# EAGLE schematic LED Array (EAGLE 6.3)
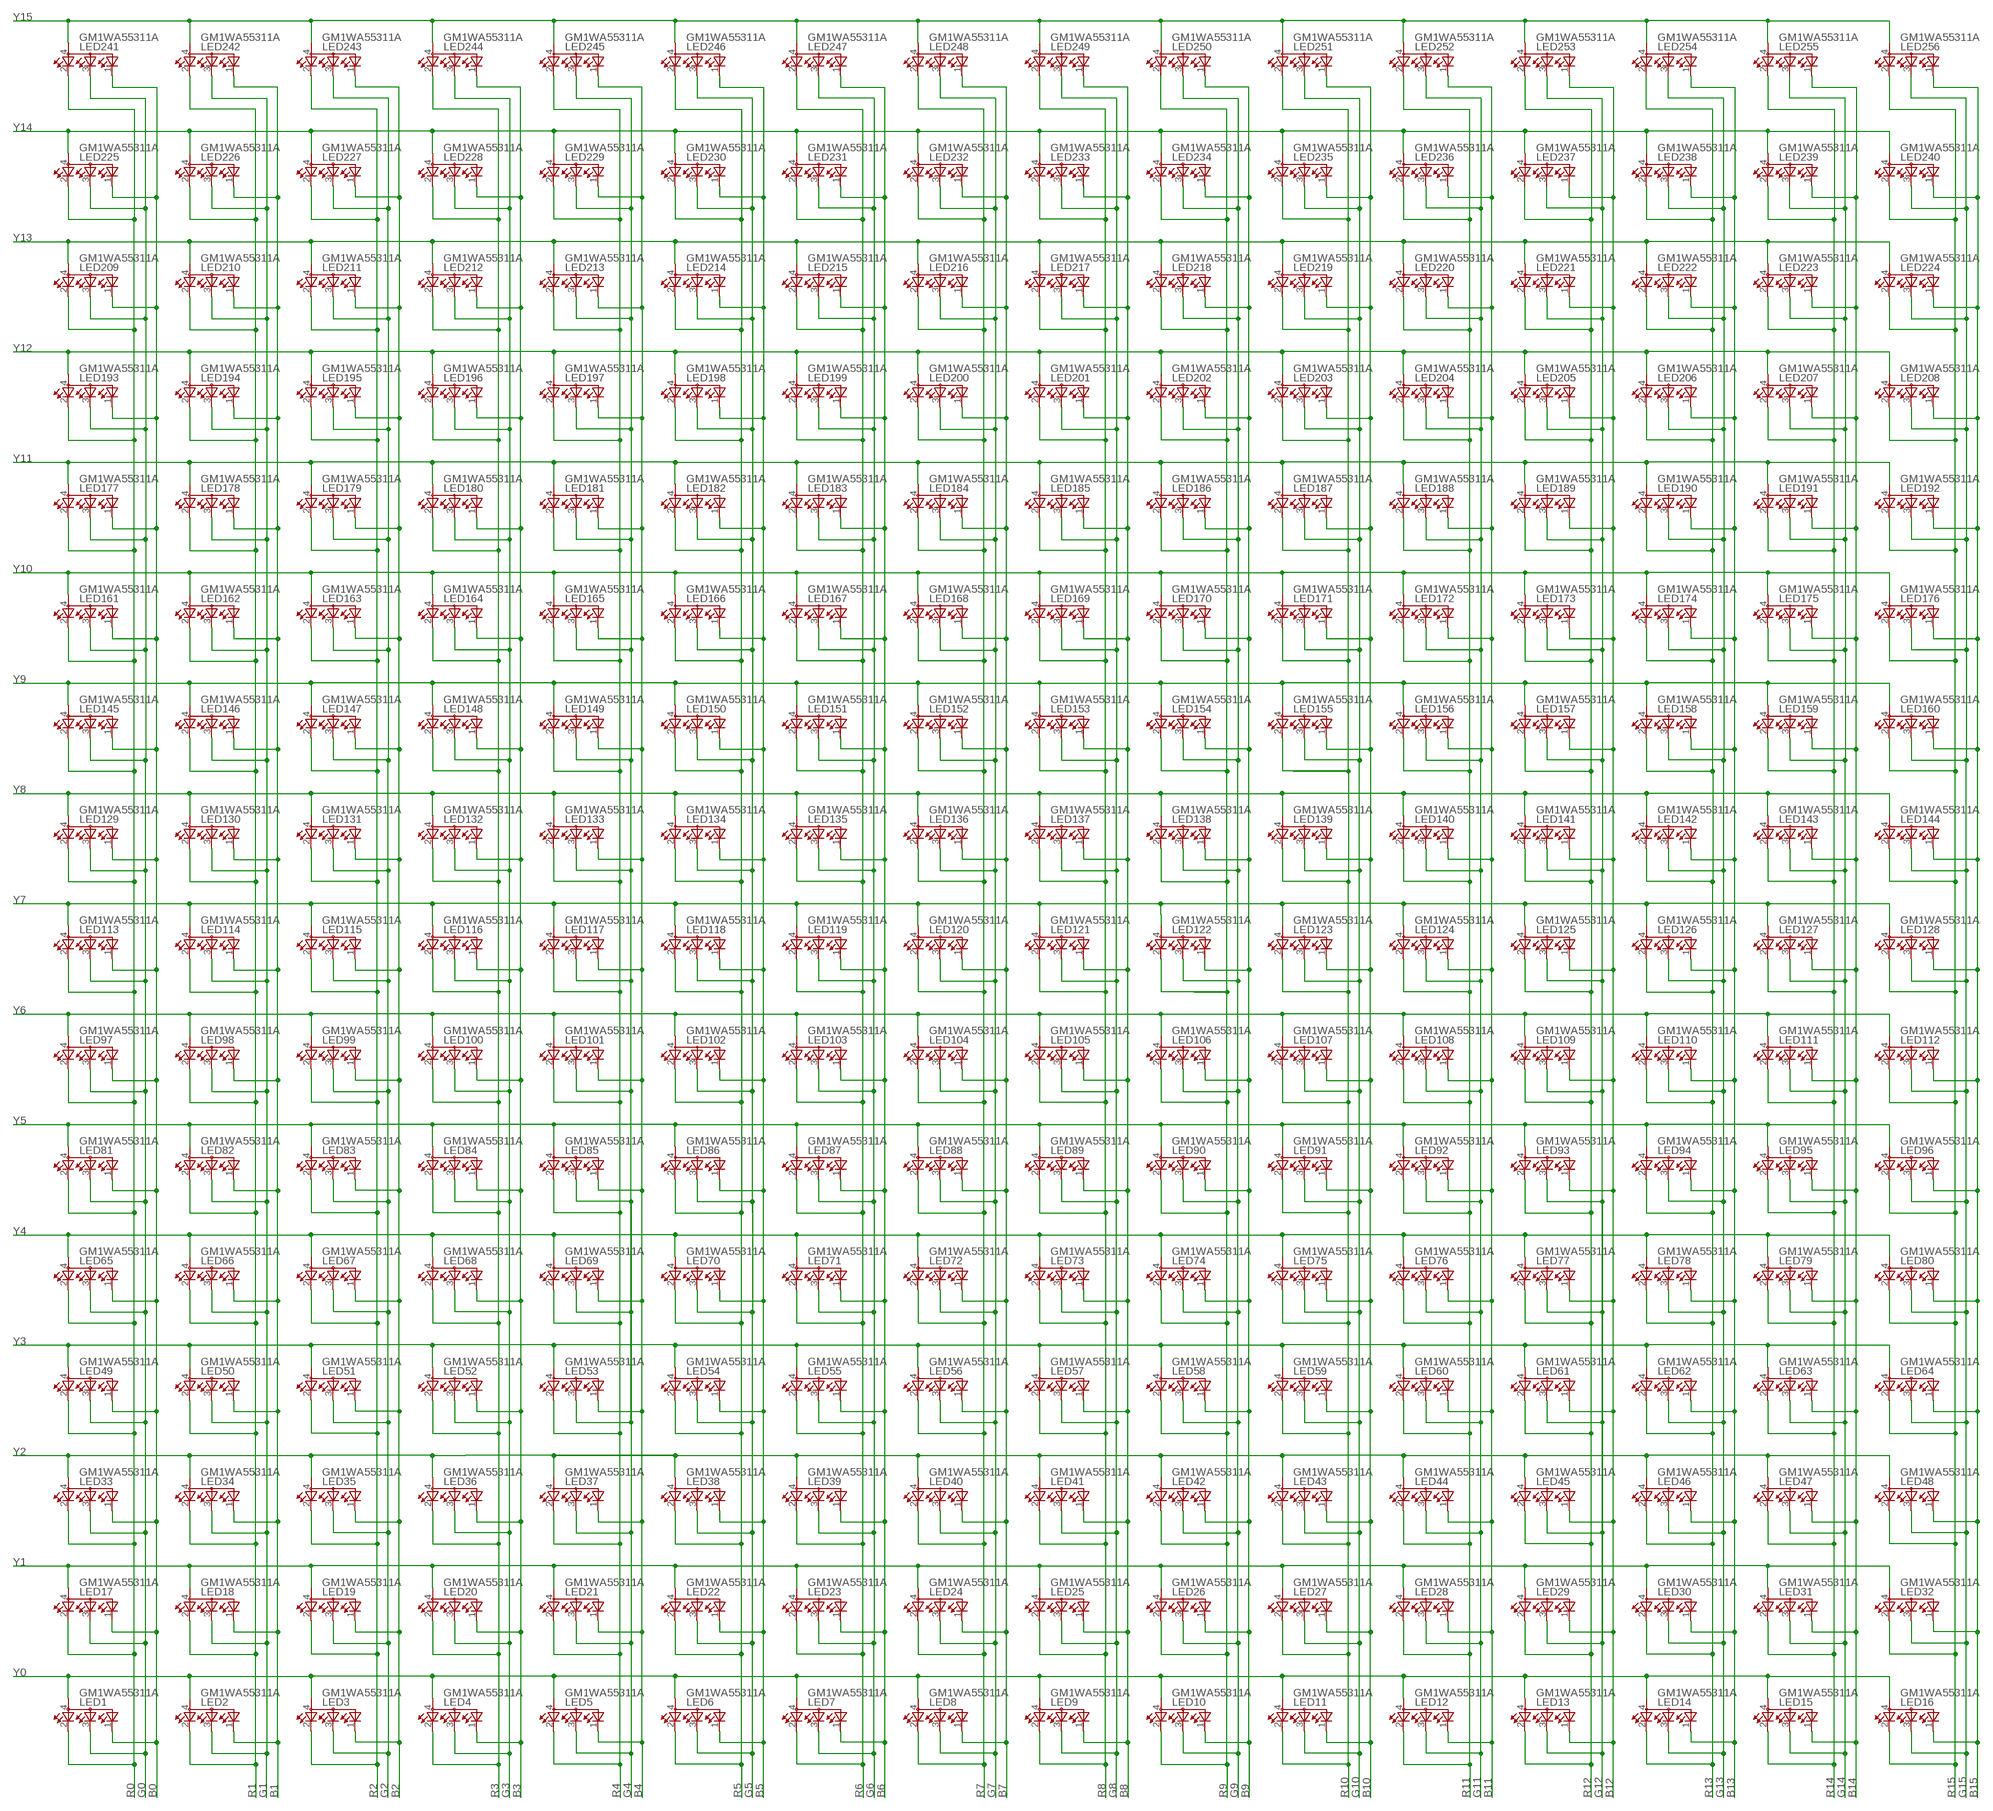
[diagram p0: schematic, sheet 1]

## Parts
LED1  GM1WA55311A  [GM1WA55311A]
LED2  GM1WA55311A  [GM1WA55311A]
LED3  GM1WA55311A  [GM1WA55311A]
LED4  GM1WA55311A  [GM1WA55311A]
LED5  GM1WA55311A  [GM1WA55311A]
LED6  GM1WA55311A  [GM1WA55311A]
LED7  GM1WA55311A  [GM1WA55311A]
LED8  GM1WA55311A  [GM1WA55311A]
LED9  GM1WA55311A  [GM1WA55311A]
LED10  GM1WA55311A  [GM1WA55311A]
LED11  GM1WA55311A  [GM1WA55311A]
LED12  GM1WA55311A  [GM1WA55311A]
LED13  GM1WA55311A  [GM1WA55311A]
LED14  GM1WA55311A  [GM1WA55311A]
LED15  GM1WA55311A  [GM1WA55311A]
LED16  GM1WA55311A  [GM1WA55311A]
LED17  GM1WA55311A  [GM1WA55311A]
LED18  GM1WA55311A  [GM1WA55311A]
LED19  GM1WA55311A  [GM1WA55311A]
LED20  GM1WA55311A  [GM1WA55311A]
LED21  GM1WA55311A  [GM1WA55311A]
LED22  GM1WA55311A  [GM1WA55311A]
LED23  GM1WA55311A  [GM1WA55311A]
LED24  GM1WA55311A  [GM1WA55311A]
LED25  GM1WA55311A  [GM1WA55311A]
LED26  GM1WA55311A  [GM1WA55311A]
LED27  GM1WA55311A  [GM1WA55311A]
LED28  GM1WA55311A  [GM1WA55311A]
LED29  GM1WA55311A  [GM1WA55311A]
LED30  GM1WA55311A  [GM1WA55311A]
LED31  GM1WA55311A  [GM1WA55311A]
LED32  GM1WA55311A  [GM1WA55311A]
LED33  GM1WA55311A  [GM1WA55311A]
LED34  GM1WA55311A  [GM1WA55311A]
LED35  GM1WA55311A  [GM1WA55311A]
LED36  GM1WA55311A  [GM1WA55311A]
LED37  GM1WA55311A  [GM1WA55311A]
LED38  GM1WA55311A  [GM1WA55311A]
LED39  GM1WA55311A  [GM1WA55311A]
LED40  GM1WA55311A  [GM1WA55311A]
LED41  GM1WA55311A  [GM1WA55311A]
LED42  GM1WA55311A  [GM1WA55311A]
LED43  GM1WA55311A  [GM1WA55311A]
LED44  GM1WA55311A  [GM1WA55311A]
LED45  GM1WA55311A  [GM1WA55311A]
LED46  GM1WA55311A  [GM1WA55311A]
LED47  GM1WA55311A  [GM1WA55311A]
LED48  GM1WA55311A  [GM1WA55311A]
LED49  GM1WA55311A  [GM1WA55311A]
LED50  GM1WA55311A  [GM1WA55311A]
LED51  GM1WA55311A  [GM1WA55311A]
LED52  GM1WA55311A  [GM1WA55311A]
LED53  GM1WA55311A  [GM1WA55311A]
LED54  GM1WA55311A  [GM1WA55311A]
LED55  GM1WA55311A  [GM1WA55311A]
LED56  GM1WA55311A  [GM1WA55311A]
LED57  GM1WA55311A  [GM1WA55311A]
LED58  GM1WA55311A  [GM1WA55311A]
LED59  GM1WA55311A  [GM1WA55311A]
LED60  GM1WA55311A  [GM1WA55311A]
LED61  GM1WA55311A  [GM1WA55311A]
LED62  GM1WA55311A  [GM1WA55311A]
LED63  GM1WA55311A  [GM1WA55311A]
LED64  GM1WA55311A  [GM1WA55311A]
LED65  GM1WA55311A  [GM1WA55311A]
LED66  GM1WA55311A  [GM1WA55311A]
LED67  GM1WA55311A  [GM1WA55311A]
LED68  GM1WA55311A  [GM1WA55311A]
LED69  GM1WA55311A  [GM1WA55311A]
LED70  GM1WA55311A  [GM1WA55311A]
LED71  GM1WA55311A  [GM1WA55311A]
LED72  GM1WA55311A  [GM1WA55311A]
LED73  GM1WA55311A  [GM1WA55311A]
LED74  GM1WA55311A  [GM1WA55311A]
LED75  GM1WA55311A  [GM1WA55311A]
LED76  GM1WA55311A  [GM1WA55311A]
LED77  GM1WA55311A  [GM1WA55311A]
LED78  GM1WA55311A  [GM1WA55311A]
LED79  GM1WA55311A  [GM1WA55311A]
LED80  GM1WA55311A  [GM1WA55311A]
LED81  GM1WA55311A  [GM1WA55311A]
LED82  GM1WA55311A  [GM1WA55311A]
LED83  GM1WA55311A  [GM1WA55311A]
LED84  GM1WA55311A  [GM1WA55311A]
LED85  GM1WA55311A  [GM1WA55311A]
LED86  GM1WA55311A  [GM1WA55311A]
LED87  GM1WA55311A  [GM1WA55311A]
LED88  GM1WA55311A  [GM1WA55311A]
LED89  GM1WA55311A  [GM1WA55311A]
LED90  GM1WA55311A  [GM1WA55311A]
LED91  GM1WA55311A  [GM1WA55311A]
LED92  GM1WA55311A  [GM1WA55311A]
LED93  GM1WA55311A  [GM1WA55311A]
LED94  GM1WA55311A  [GM1WA55311A]
LED95  GM1WA55311A  [GM1WA55311A]
LED96  GM1WA55311A  [GM1WA55311A]
LED97  GM1WA55311A  [GM1WA55311A]
LED98  GM1WA55311A  [GM1WA55311A]
LED99  GM1WA55311A  [GM1WA55311A]
LED100  GM1WA55311A  [GM1WA55311A]
LED101  GM1WA55311A  [GM1WA55311A]
LED102  GM1WA55311A  [GM1WA55311A]
LED103  GM1WA55311A  [GM1WA55311A]
LED104  GM1WA55311A  [GM1WA55311A]
LED105  GM1WA55311A  [GM1WA55311A]
LED106  GM1WA55311A  [GM1WA55311A]
LED107  GM1WA55311A  [GM1WA55311A]
LED108  GM1WA55311A  [GM1WA55311A]
LED109  GM1WA55311A  [GM1WA55311A]
LED110  GM1WA55311A  [GM1WA55311A]
LED111  GM1WA55311A  [GM1WA55311A]
LED112  GM1WA55311A  [GM1WA55311A]
LED113  GM1WA55311A  [GM1WA55311A]
LED114  GM1WA55311A  [GM1WA55311A]
LED115  GM1WA55311A  [GM1WA55311A]
LED116  GM1WA55311A  [GM1WA55311A]
LED117  GM1WA55311A  [GM1WA55311A]
LED118  GM1WA55311A  [GM1WA55311A]
LED119  GM1WA55311A  [GM1WA55311A]
LED120  GM1WA55311A  [GM1WA55311A]
LED121  GM1WA55311A  [GM1WA55311A]
LED122  GM1WA55311A  [GM1WA55311A]
LED123  GM1WA55311A  [GM1WA55311A]
LED124  GM1WA55311A  [GM1WA55311A]
LED125  GM1WA55311A  [GM1WA55311A]
LED126  GM1WA55311A  [GM1WA55311A]
LED127  GM1WA55311A  [GM1WA55311A]
LED128  GM1WA55311A  [GM1WA55311A]
LED129  GM1WA55311A  [GM1WA55311A]
LED130  GM1WA55311A  [GM1WA55311A]
LED131  GM1WA55311A  [GM1WA55311A]
LED132  GM1WA55311A  [GM1WA55311A]
LED133  GM1WA55311A  [GM1WA55311A]
LED134  GM1WA55311A  [GM1WA55311A]
LED135  GM1WA55311A  [GM1WA55311A]
LED136  GM1WA55311A  [GM1WA55311A]
LED137  GM1WA55311A  [GM1WA55311A]
LED138  GM1WA55311A  [GM1WA55311A]
LED139  GM1WA55311A  [GM1WA55311A]
LED140  GM1WA55311A  [GM1WA55311A]
LED141  GM1WA55311A  [GM1WA55311A]
LED142  GM1WA55311A  [GM1WA55311A]
LED143  GM1WA55311A  [GM1WA55311A]
LED144  GM1WA55311A  [GM1WA55311A]
LED145  GM1WA55311A  [GM1WA55311A]
LED146  GM1WA55311A  [GM1WA55311A]
LED147  GM1WA55311A  [GM1WA55311A]
LED148  GM1WA55311A  [GM1WA55311A]
LED149  GM1WA55311A  [GM1WA55311A]
LED150  GM1WA55311A  [GM1WA55311A]
LED151  GM1WA55311A  [GM1WA55311A]
LED152  GM1WA55311A  [GM1WA55311A]
LED153  GM1WA55311A  [GM1WA55311A]
LED154  GM1WA55311A  [GM1WA55311A]
LED155  GM1WA55311A  [GM1WA55311A]
LED156  GM1WA55311A  [GM1WA55311A]
LED157  GM1WA55311A  [GM1WA55311A]
LED158  GM1WA55311A  [GM1WA55311A]
LED159  GM1WA55311A  [GM1WA55311A]
LED160  GM1WA55311A  [GM1WA55311A]
LED161  GM1WA55311A  [GM1WA55311A]
LED162  GM1WA55311A  [GM1WA55311A]
LED163  GM1WA55311A  [GM1WA55311A]
LED164  GM1WA55311A  [GM1WA55311A]
LED165  GM1WA55311A  [GM1WA55311A]
LED166  GM1WA55311A  [GM1WA55311A]
LED167  GM1WA55311A  [GM1WA55311A]
LED168  GM1WA55311A  [GM1WA55311A]
LED169  GM1WA55311A  [GM1WA55311A]
LED170  GM1WA55311A  [GM1WA55311A]
LED171  GM1WA55311A  [GM1WA55311A]
LED172  GM1WA55311A  [GM1WA55311A]
LED173  GM1WA55311A  [GM1WA55311A]
LED174  GM1WA55311A  [GM1WA55311A]
LED175  GM1WA55311A  [GM1WA55311A]
LED176  GM1WA55311A  [GM1WA55311A]
LED177  GM1WA55311A  [GM1WA55311A]
LED178  GM1WA55311A  [GM1WA55311A]
LED179  GM1WA55311A  [GM1WA55311A]
LED180  GM1WA55311A  [GM1WA55311A]
LED181  GM1WA55311A  [GM1WA55311A]
LED182  GM1WA55311A  [GM1WA55311A]
LED183  GM1WA55311A  [GM1WA55311A]
LED184  GM1WA55311A  [GM1WA55311A]
LED185  GM1WA55311A  [GM1WA55311A]
LED186  GM1WA55311A  [GM1WA55311A]
LED187  GM1WA55311A  [GM1WA55311A]
LED188  GM1WA55311A  [GM1WA55311A]
LED189  GM1WA55311A  [GM1WA55311A]
LED190  GM1WA55311A  [GM1WA55311A]
LED191  GM1WA55311A  [GM1WA55311A]
LED192  GM1WA55311A  [GM1WA55311A]
LED193  GM1WA55311A  [GM1WA55311A]
LED194  GM1WA55311A  [GM1WA55311A]
LED195  GM1WA55311A  [GM1WA55311A]
LED196  GM1WA55311A  [GM1WA55311A]
LED197  GM1WA55311A  [GM1WA55311A]
LED198  GM1WA55311A  [GM1WA55311A]
LED199  GM1WA55311A  [GM1WA55311A]
LED200  GM1WA55311A  [GM1WA55311A]
LED201  GM1WA55311A  [GM1WA55311A]
LED202  GM1WA55311A  [GM1WA55311A]
LED203  GM1WA55311A  [GM1WA55311A]
LED204  GM1WA55311A  [GM1WA55311A]
LED205  GM1WA55311A  [GM1WA55311A]
LED206  GM1WA55311A  [GM1WA55311A]
LED207  GM1WA55311A  [GM1WA55311A]
LED208  GM1WA55311A  [GM1WA55311A]
LED209  GM1WA55311A  [GM1WA55311A]
LED210  GM1WA55311A  [GM1WA55311A]
LED211  GM1WA55311A  [GM1WA55311A]
LED212  GM1WA55311A  [GM1WA55311A]
LED213  GM1WA55311A  [GM1WA55311A]
LED214  GM1WA55311A  [GM1WA55311A]
LED215  GM1WA55311A  [GM1WA55311A]
LED216  GM1WA55311A  [GM1WA55311A]
LED217  GM1WA55311A  [GM1WA55311A]
LED218  GM1WA55311A  [GM1WA55311A]
LED219  GM1WA55311A  [GM1WA55311A]
LED220  GM1WA55311A  [GM1WA55311A]
LED221  GM1WA55311A  [GM1WA55311A]
LED222  GM1WA55311A  [GM1WA55311A]
LED223  GM1WA55311A  [GM1WA55311A]
LED224  GM1WA55311A  [GM1WA55311A]
LED225  GM1WA55311A  [GM1WA55311A]
LED226  GM1WA55311A  [GM1WA55311A]
LED227  GM1WA55311A  [GM1WA55311A]
LED228  GM1WA55311A  [GM1WA55311A]
LED229  GM1WA55311A  [GM1WA55311A]
LED230  GM1WA55311A  [GM1WA55311A]
LED231  GM1WA55311A  [GM1WA55311A]
LED232  GM1WA55311A  [GM1WA55311A]
LED233  GM1WA55311A  [GM1WA55311A]
LED234  GM1WA55311A  [GM1WA55311A]
LED235  GM1WA55311A  [GM1WA55311A]
LED236  GM1WA55311A  [GM1WA55311A]
LED237  GM1WA55311A  [GM1WA55311A]
LED238  GM1WA55311A  [GM1WA55311A]
LED239  GM1WA55311A  [GM1WA55311A]
LED240  GM1WA55311A  [GM1WA55311A]
LED241  GM1WA55311A  [GM1WA55311A]
LED242  GM1WA55311A  [GM1WA55311A]
LED243  GM1WA55311A  [GM1WA55311A]
LED244  GM1WA55311A  [GM1WA55311A]
LED245  GM1WA55311A  [GM1WA55311A]
LED246  GM1WA55311A  [GM1WA55311A]
LED247  GM1WA55311A  [GM1WA55311A]
LED248  GM1WA55311A  [GM1WA55311A]
LED249  GM1WA55311A  [GM1WA55311A]
LED250  GM1WA55311A  [GM1WA55311A]
LED251  GM1WA55311A  [GM1WA55311A]
LED252  GM1WA55311A  [GM1WA55311A]
LED253  GM1WA55311A  [GM1WA55311A]
LED254  GM1WA55311A  [GM1WA55311A]
LED255  GM1WA55311A  [GM1WA55311A]
LED256  GM1WA55311A  [GM1WA55311A]

## Nets
B0: LED1.1(CGREEN) LED17.1(CGREEN) LED33.1(CGREEN) LED49.1(CGREEN) LED65.1(CGREEN) LED81.1(CGREEN) LED97.1(CGREEN) LED113.1(CGREEN) LED129.1(CGREEN) LED145.1(CGREEN) LED161.1(CGREEN) LED177.1(CGREEN) LED193.1(CGREEN) LED209.1(CGREEN) LED225.1(CGREEN) LED241.1(CGREEN)
B1: LED2.1(CGREEN) LED18.1(CGREEN) LED34.1(CGREEN) LED50.1(CGREEN) LED66.1(CGREEN) LED82.1(CGREEN) LED98.1(CGREEN) LED114.1(CGREEN) LED130.1(CGREEN) LED146.1(CGREEN) LED162.1(CGREEN) LED178.1(CGREEN) LED194.1(CGREEN) LED210.1(CGREEN) LED226.1(CGREEN) LED242.1(CGREEN)
B2: LED3.1(CGREEN) LED19.1(CGREEN) LED35.1(CGREEN) LED51.1(CGREEN) LED67.1(CGREEN) LED83.1(CGREEN) LED99.1(CGREEN) LED115.1(CGREEN) LED131.1(CGREEN) LED147.1(CGREEN) LED163.1(CGREEN) LED179.1(CGREEN) LED195.1(CGREEN) LED211.1(CGREEN) LED227.1(CGREEN) LED243.1(CGREEN)
B3: LED4.1(CGREEN) LED20.1(CGREEN) LED36.1(CGREEN) LED52.1(CGREEN) LED68.1(CGREEN) LED84.1(CGREEN) LED100.1(CGREEN) LED116.1(CGREEN) LED132.1(CGREEN) LED148.1(CGREEN) LED164.1(CGREEN) LED180.1(CGREEN) LED196.1(CGREEN) LED212.1(CGREEN) LED228.1(CGREEN) LED244.1(CGREEN)
B4: LED5.1(CGREEN) LED21.1(CGREEN) LED37.1(CGREEN) LED53.1(CGREEN) LED69.1(CGREEN) LED85.1(CGREEN) LED101.1(CGREEN) LED117.1(CGREEN) LED133.1(CGREEN) LED149.1(CGREEN) LED165.1(CGREEN) LED181.1(CGREEN) LED197.1(CGREEN) LED213.1(CGREEN) LED229.1(CGREEN) LED245.1(CGREEN)
B5: LED6.1(CGREEN) LED22.1(CGREEN) LED38.1(CGREEN) LED54.1(CGREEN) LED70.1(CGREEN) LED86.1(CGREEN) LED102.1(CGREEN) LED118.1(CGREEN) LED134.1(CGREEN) LED150.1(CGREEN) LED166.1(CGREEN) LED182.1(CGREEN) LED198.1(CGREEN) LED214.1(CGREEN) LED230.1(CGREEN) LED246.1(CGREEN)
B6: LED7.1(CGREEN) LED23.1(CGREEN) LED39.1(CGREEN) LED55.1(CGREEN) LED71.1(CGREEN) LED87.1(CGREEN) LED103.1(CGREEN) LED119.1(CGREEN) LED135.1(CGREEN) LED151.1(CGREEN) LED167.1(CGREEN) LED183.1(CGREEN) LED199.1(CGREEN) LED215.1(CGREEN) LED231.1(CGREEN) LED247.1(CGREEN)
B7: LED8.1(CGREEN) LED24.1(CGREEN) LED40.1(CGREEN) LED56.1(CGREEN) LED72.1(CGREEN) LED88.1(CGREEN) LED104.1(CGREEN) LED120.1(CGREEN) LED136.1(CGREEN) LED152.1(CGREEN) LED168.1(CGREEN) LED184.1(CGREEN) LED200.1(CGREEN) LED216.1(CGREEN) LED232.1(CGREEN) LED248.1(CGREEN)
B8: LED9.1(CGREEN) LED25.1(CGREEN) LED41.1(CGREEN) LED57.1(CGREEN) LED73.1(CGREEN) LED89.1(CGREEN) LED105.1(CGREEN) LED121.1(CGREEN) LED137.1(CGREEN) LED153.1(CGREEN) LED169.1(CGREEN) LED185.1(CGREEN) LED201.1(CGREEN) LED217.1(CGREEN) LED233.1(CGREEN) LED249.1(CGREEN)
B9: LED10.1(CGREEN) LED26.1(CGREEN) LED42.1(CGREEN) LED58.1(CGREEN) LED74.1(CGREEN) LED90.1(CGREEN) LED106.1(CGREEN) LED122.1(CGREEN) LED138.1(CGREEN) LED154.1(CGREEN) LED170.1(CGREEN) LED186.1(CGREEN) LED202.1(CGREEN) LED218.1(CGREEN) LED234.1(CGREEN) LED250.1(CGREEN)
B10: LED11.1(CGREEN) LED27.1(CGREEN) LED43.1(CGREEN) LED59.1(CGREEN) LED75.1(CGREEN) LED91.1(CGREEN) LED107.1(CGREEN) LED123.1(CGREEN) LED139.1(CGREEN) LED155.1(CGREEN) LED171.1(CGREEN) LED187.1(CGREEN) LED203.1(CGREEN) LED219.1(CGREEN) LED235.1(CGREEN) LED251.1(CGREEN)
B11: LED12.1(CGREEN) LED28.1(CGREEN) LED44.1(CGREEN) LED60.1(CGREEN) LED76.1(CGREEN) LED92.1(CGREEN) LED108.1(CGREEN) LED124.1(CGREEN) LED140.1(CGREEN) LED156.1(CGREEN) LED172.1(CGREEN) LED188.1(CGREEN) LED204.1(CGREEN) LED220.1(CGREEN) LED236.1(CGREEN) LED252.1(CGREEN)
B12: LED13.1(CGREEN) LED29.1(CGREEN) LED45.1(CGREEN) LED61.1(CGREEN) LED77.1(CGREEN) LED93.1(CGREEN) LED109.1(CGREEN) LED125.1(CGREEN) LED141.1(CGREEN) LED157.1(CGREEN) LED173.1(CGREEN) LED189.1(CGREEN) LED205.1(CGREEN) LED221.1(CGREEN) LED237.1(CGREEN) LED253.1(CGREEN)
B13: LED14.1(CGREEN) LED30.1(CGREEN) LED46.1(CGREEN) LED62.1(CGREEN) LED78.1(CGREEN) LED94.1(CGREEN) LED110.1(CGREEN) LED126.1(CGREEN) LED142.1(CGREEN) LED158.1(CGREEN) LED174.1(CGREEN) LED190.1(CGREEN) LED206.1(CGREEN) LED222.1(CGREEN) LED238.1(CGREEN) LED254.1(CGREEN)
B14: LED15.1(CGREEN) LED31.1(CGREEN) LED47.1(CGREEN) LED63.1(CGREEN) LED79.1(CGREEN) LED95.1(CGREEN) LED111.1(CGREEN) LED127.1(CGREEN) LED143.1(CGREEN) LED159.1(CGREEN) LED175.1(CGREEN) LED191.1(CGREEN) LED207.1(CGREEN) LED223.1(CGREEN) LED239.1(CGREEN) LED255.1(CGREEN)
B15: LED16.1(CGREEN) LED32.1(CGREEN) LED48.1(CGREEN) LED64.1(CGREEN) LED80.1(CGREEN) LED96.1(CGREEN) LED112.1(CGREEN) LED128.1(CGREEN) LED144.1(CGREEN) LED160.1(CGREEN) LED176.1(CGREEN) LED192.1(CGREEN) LED208.1(CGREEN) LED224.1(CGREEN) LED240.1(CGREEN) LED256.1(CGREEN)
G0: LED1.3(CBLUE) LED17.3(CBLUE) LED33.3(CBLUE) LED49.3(CBLUE) LED65.3(CBLUE) LED81.3(CBLUE) LED97.3(CBLUE) LED113.3(CBLUE) LED129.3(CBLUE) LED145.3(CBLUE) LED161.3(CBLUE) LED177.3(CBLUE) LED193.3(CBLUE) LED209.3(CBLUE) LED225.3(CBLUE) LED241.3(CBLUE)
G1: LED2.3(CBLUE) LED18.3(CBLUE) LED34.3(CBLUE) LED50.3(CBLUE) LED66.3(CBLUE) LED82.3(CBLUE) LED98.3(CBLUE) LED114.3(CBLUE) LED130.3(CBLUE) LED146.3(CBLUE) LED162.3(CBLUE) LED178.3(CBLUE) LED194.3(CBLUE) LED210.3(CBLUE) LED226.3(CBLUE) LED242.3(CBLUE)
G2: LED3.3(CBLUE) LED19.3(CBLUE) LED35.3(CBLUE) LED51.3(CBLUE) LED67.3(CBLUE) LED83.3(CBLUE) LED99.3(CBLUE) LED115.3(CBLUE) LED131.3(CBLUE) LED147.3(CBLUE) LED163.3(CBLUE) LED179.3(CBLUE) LED195.3(CBLUE) LED211.3(CBLUE) LED227.3(CBLUE) LED243.3(CBLUE)
G3: LED4.3(CBLUE) LED20.3(CBLUE) LED36.3(CBLUE) LED52.3(CBLUE) LED68.3(CBLUE) LED84.3(CBLUE) LED100.3(CBLUE) LED116.3(CBLUE) LED132.3(CBLUE) LED148.3(CBLUE) LED164.3(CBLUE) LED180.3(CBLUE) LED196.3(CBLUE) LED212.3(CBLUE) LED228.3(CBLUE) LED244.3(CBLUE)
G4: LED5.3(CBLUE) LED21.3(CBLUE) LED37.3(CBLUE) LED53.3(CBLUE) LED69.3(CBLUE) LED85.3(CBLUE) LED101.3(CBLUE) LED117.3(CBLUE) LED133.3(CBLUE) LED149.3(CBLUE) LED165.3(CBLUE) LED181.3(CBLUE) LED197.3(CBLUE) LED213.3(CBLUE) LED229.3(CBLUE) LED245.3(CBLUE)
G5: LED6.3(CBLUE) LED22.3(CBLUE) LED38.3(CBLUE) LED54.3(CBLUE) LED70.3(CBLUE) LED86.3(CBLUE) LED102.3(CBLUE) LED118.3(CBLUE) LED134.3(CBLUE) LED150.3(CBLUE) LED166.3(CBLUE) LED182.3(CBLUE) LED198.3(CBLUE) LED214.3(CBLUE) LED230.3(CBLUE) LED246.3(CBLUE)
G6: LED7.3(CBLUE) LED23.3(CBLUE) LED39.3(CBLUE) LED55.3(CBLUE) LED71.3(CBLUE) LED87.3(CBLUE) LED103.3(CBLUE) LED119.3(CBLUE) LED135.3(CBLUE) LED151.3(CBLUE) LED167.3(CBLUE) LED183.3(CBLUE) LED199.3(CBLUE) LED215.3(CBLUE) LED231.3(CBLUE) LED247.3(CBLUE)
G7: LED8.3(CBLUE) LED24.3(CBLUE) LED40.3(CBLUE) LED56.3(CBLUE) LED72.3(CBLUE) LED88.3(CBLUE) LED104.3(CBLUE) LED120.3(CBLUE) LED136.3(CBLUE) LED152.3(CBLUE) LED168.3(CBLUE) LED184.3(CBLUE) LED200.3(CBLUE) LED216.3(CBLUE) LED232.3(CBLUE) LED248.3(CBLUE)
G8: LED9.3(CBLUE) LED25.3(CBLUE) LED41.3(CBLUE) LED57.3(CBLUE) LED73.3(CBLUE) LED89.3(CBLUE) LED105.3(CBLUE) LED121.3(CBLUE) LED137.3(CBLUE) LED153.3(CBLUE) LED169.3(CBLUE) LED185.3(CBLUE) LED201.3(CBLUE) LED217.3(CBLUE) LED233.3(CBLUE) LED249.3(CBLUE)
G9: LED10.3(CBLUE) LED26.3(CBLUE) LED42.3(CBLUE) LED58.3(CBLUE) LED74.3(CBLUE) LED90.3(CBLUE) LED106.3(CBLUE) LED122.3(CBLUE) LED138.3(CBLUE) LED154.3(CBLUE) LED170.3(CBLUE) LED186.3(CBLUE) LED202.3(CBLUE) LED218.3(CBLUE) LED234.3(CBLUE) LED250.3(CBLUE)
G10: LED11.3(CBLUE) LED27.3(CBLUE) LED43.3(CBLUE) LED59.3(CBLUE) LED75.3(CBLUE) LED91.3(CBLUE) LED107.3(CBLUE) LED123.3(CBLUE) LED139.3(CBLUE) LED155.3(CBLUE) LED171.3(CBLUE) LED187.3(CBLUE) LED203.3(CBLUE) LED219.3(CBLUE) LED235.3(CBLUE) LED251.3(CBLUE)
G11: LED12.3(CBLUE) LED28.3(CBLUE) LED44.3(CBLUE) LED60.3(CBLUE) LED76.3(CBLUE) LED92.3(CBLUE) LED108.3(CBLUE) LED124.3(CBLUE) LED140.3(CBLUE) LED156.3(CBLUE) LED172.3(CBLUE) LED188.3(CBLUE) LED204.3(CBLUE) LED220.3(CBLUE) LED236.3(CBLUE) LED252.3(CBLUE)
G12: LED13.3(CBLUE) LED29.3(CBLUE) LED45.3(CBLUE) LED61.3(CBLUE) LED77.3(CBLUE) LED93.3(CBLUE) LED109.3(CBLUE) LED125.3(CBLUE) LED141.3(CBLUE) LED157.3(CBLUE) LED173.3(CBLUE) LED189.3(CBLUE) LED205.3(CBLUE) LED221.3(CBLUE) LED237.3(CBLUE) LED253.3(CBLUE)
G13: LED14.3(CBLUE) LED30.3(CBLUE) LED46.3(CBLUE) LED62.3(CBLUE) LED78.3(CBLUE) LED94.3(CBLUE) LED110.3(CBLUE) LED126.3(CBLUE) LED142.3(CBLUE) LED158.3(CBLUE) LED174.3(CBLUE) LED190.3(CBLUE) LED206.3(CBLUE) LED222.3(CBLUE) LED238.3(CBLUE) LED254.3(CBLUE)
G14: LED15.3(CBLUE) LED31.3(CBLUE) LED47.3(CBLUE) LED63.3(CBLUE) LED79.3(CBLUE) LED95.3(CBLUE) LED111.3(CBLUE) LED127.3(CBLUE) LED143.3(CBLUE) LED159.3(CBLUE) LED175.3(CBLUE) LED191.3(CBLUE) LED207.3(CBLUE) LED223.3(CBLUE) LED239.3(CBLUE) LED255.3(CBLUE)
G15: LED16.3(CBLUE) LED32.3(CBLUE) LED48.3(CBLUE) LED64.3(CBLUE) LED80.3(CBLUE) LED96.3(CBLUE) LED112.3(CBLUE) LED128.3(CBLUE) LED144.3(CBLUE) LED160.3(CBLUE) LED176.3(CBLUE) LED192.3(CBLUE) LED208.3(CBLUE) LED224.3(CBLUE) LED240.3(CBLUE) LED256.3(CBLUE)
R0: LED1.2(CRED) LED17.2(CRED) LED33.2(CRED) LED49.2(CRED) LED65.2(CRED) LED81.2(CRED) LED97.2(CRED) LED113.2(CRED) LED129.2(CRED) LED145.2(CRED) LED161.2(CRED) LED177.2(CRED) LED193.2(CRED) LED209.2(CRED) LED225.2(CRED) LED241.2(CRED)
R1: LED2.2(CRED) LED18.2(CRED) LED34.2(CRED) LED50.2(CRED) LED66.2(CRED) LED82.2(CRED) LED98.2(CRED) LED114.2(CRED) LED130.2(CRED) LED146.2(CRED) LED162.2(CRED) LED178.2(CRED) LED194.2(CRED) LED210.2(CRED) LED226.2(CRED) LED242.2(CRED)
R2: LED3.2(CRED) LED19.2(CRED) LED35.2(CRED) LED51.2(CRED) LED67.2(CRED) LED83.2(CRED) LED99.2(CRED) LED115.2(CRED) LED131.2(CRED) LED147.2(CRED) LED163.2(CRED) LED179.2(CRED) LED195.2(CRED) LED211.2(CRED) LED227.2(CRED) LED243.2(CRED)
R3: LED4.2(CRED) LED20.2(CRED) LED36.2(CRED) LED52.2(CRED) LED68.2(CRED) LED84.2(CRED) LED100.2(CRED) LED116.2(CRED) LED132.2(CRED) LED148.2(CRED) LED164.2(CRED) LED180.2(CRED) LED196.2(CRED) LED212.2(CRED) LED228.2(CRED) LED244.2(CRED)
R4: LED5.2(CRED) LED21.2(CRED) LED37.2(CRED) LED53.2(CRED) LED69.2(CRED) LED85.2(CRED) LED101.2(CRED) LED117.2(CRED) LED133.2(CRED) LED149.2(CRED) LED165.2(CRED) LED181.2(CRED) LED197.2(CRED) LED213.2(CRED) LED229.2(CRED) LED245.2(CRED)
R5: LED6.2(CRED) LED22.2(CRED) LED38.2(CRED) LED54.2(CRED) LED70.2(CRED) LED86.2(CRED) LED102.2(CRED) LED118.2(CRED) LED134.2(CRED) LED150.2(CRED) LED166.2(CRED) LED182.2(CRED) LED198.2(CRED) LED214.2(CRED) LED230.2(CRED) LED246.2(CRED)
R6: LED7.2(CRED) LED23.2(CRED) LED39.2(CRED) LED55.2(CRED) LED71.2(CRED) LED87.2(CRED) LED103.2(CRED) LED119.2(CRED) LED135.2(CRED) LED151.2(CRED) LED167.2(CRED) LED183.2(CRED) LED199.2(CRED) LED215.2(CRED) LED231.2(CRED) LED247.2(CRED)
R7: LED8.2(CRED) LED24.2(CRED) LED40.2(CRED) LED56.2(CRED) LED72.2(CRED) LED88.2(CRED) LED104.2(CRED) LED120.2(CRED) LED136.2(CRED) LED152.2(CRED) LED168.2(CRED) LED184.2(CRED) LED200.2(CRED) LED216.2(CRED) LED232.2(CRED) LED248.2(CRED)
R8: LED9.2(CRED) LED25.2(CRED) LED41.2(CRED) LED57.2(CRED) LED73.2(CRED) LED89.2(CRED) LED105.2(CRED) LED121.2(CRED) LED137.2(CRED) LED153.2(CRED) LED169.2(CRED) LED185.2(CRED) LED201.2(CRED) LED217.2(CRED) LED233.2(CRED) LED249.2(CRED)
R9: LED10.2(CRED) LED26.2(CRED) LED42.2(CRED) LED58.2(CRED) LED74.2(CRED) LED90.2(CRED) LED106.2(CRED) LED122.2(CRED) LED138.2(CRED) LED154.2(CRED) LED170.2(CRED) LED186.2(CRED) LED202.2(CRED) LED218.2(CRED) LED234.2(CRED) LED250.2(CRED)
R10: LED11.2(CRED) LED27.2(CRED) LED43.2(CRED) LED59.2(CRED) LED75.2(CRED) LED91.2(CRED) LED107.2(CRED) LED123.2(CRED) LED139.2(CRED) LED155.2(CRED) LED171.2(CRED) LED187.2(CRED) LED203.2(CRED) LED219.2(CRED) LED235.2(CRED) LED251.2(CRED)
R11: LED12.2(CRED) LED28.2(CRED) LED44.2(CRED) LED60.2(CRED) LED76.2(CRED) LED92.2(CRED) LED108.2(CRED) LED124.2(CRED) LED140.2(CRED) LED156.2(CRED) LED172.2(CRED) LED188.2(CRED) LED204.2(CRED) LED220.2(CRED) LED236.2(CRED) LED252.2(CRED)
R12: LED13.2(CRED) LED29.2(CRED) LED45.2(CRED) LED61.2(CRED) LED77.2(CRED) LED93.2(CRED) LED109.2(CRED) LED125.2(CRED) LED141.2(CRED) LED157.2(CRED) LED173.2(CRED) LED189.2(CRED) LED205.2(CRED) LED221.2(CRED) LED237.2(CRED) LED253.2(CRED)
R13: LED14.2(CRED) LED30.2(CRED) LED46.2(CRED) LED62.2(CRED) LED78.2(CRED) LED94.2(CRED) LED110.2(CRED) LED126.2(CRED) LED142.2(CRED) LED158.2(CRED) LED174.2(CRED) LED190.2(CRED) LED206.2(CRED) LED222.2(CRED) LED238.2(CRED) LED254.2(CRED)
R14: LED15.2(CRED) LED31.2(CRED) LED47.2(CRED) LED63.2(CRED) LED79.2(CRED) LED95.2(CRED) LED111.2(CRED) LED127.2(CRED) LED143.2(CRED) LED159.2(CRED) LED175.2(CRED) LED191.2(CRED) LED207.2(CRED) LED223.2(CRED) LED239.2(CRED) LED255.2(CRED)
R15: LED16.2(CRED) LED32.2(CRED) LED48.2(CRED) LED64.2(CRED) LED80.2(CRED) LED96.2(CRED) LED112.2(CRED) LED128.2(CRED) LED144.2(CRED) LED160.2(CRED) LED176.2(CRED) LED192.2(CRED) LED208.2(CRED) LED224.2(CRED) LED240.2(CRED) LED256.2(CRED)
Y0: LED1.4(A) LED2.4(A) LED3.4(A) LED4.4(A) LED5.4(A) LED6.4(A) LED7.4(A) LED8.4(A) LED9.4(A) LED10.4(A) LED11.4(A) LED12.4(A) LED13.4(A) LED14.4(A) LED15.4(A) LED16.4(A)
Y1: LED17.4(A) LED18.4(A) LED19.4(A) LED20.4(A) LED21.4(A) LED22.4(A) LED23.4(A) LED24.4(A) LED25.4(A) LED26.4(A) LED27.4(A) LED28.4(A) LED29.4(A) LED30.4(A) LED31.4(A) LED32.4(A)
Y2: LED33.4(A) LED34.4(A) LED35.4(A) LED36.4(A) LED37.4(A) LED38.4(A) LED39.4(A) LED40.4(A) LED41.4(A) LED42.4(A) LED43.4(A) LED44.4(A) LED45.4(A) LED46.4(A) LED47.4(A) LED48.4(A)
Y3: LED49.4(A) LED50.4(A) LED51.4(A) LED52.4(A) LED53.4(A) LED54.4(A) LED55.4(A) LED56.4(A) LED57.4(A) LED58.4(A) LED59.4(A) LED60.4(A) LED61.4(A) LED62.4(A) LED63.4(A) LED64.4(A)
Y4: LED65.4(A) LED66.4(A) LED67.4(A) LED68.4(A) LED69.4(A) LED70.4(A) LED71.4(A) LED72.4(A) LED73.4(A) LED74.4(A) LED75.4(A) LED76.4(A) LED77.4(A) LED78.4(A) LED79.4(A) LED80.4(A)
Y5: LED81.4(A) LED82.4(A) LED83.4(A) LED84.4(A) LED85.4(A) LED86.4(A) LED87.4(A) LED88.4(A) LED89.4(A) LED90.4(A) LED91.4(A) LED92.4(A) LED93.4(A) LED94.4(A) LED95.4(A) LED96.4(A)
Y6: LED97.4(A) LED98.4(A) LED99.4(A) LED100.4(A) LED101.4(A) LED102.4(A) LED103.4(A) LED104.4(A) LED105.4(A) LED106.4(A) LED107.4(A) LED108.4(A) LED109.4(A) LED110.4(A) LED111.4(A) LED112.4(A)
Y7: LED113.4(A) LED114.4(A) LED115.4(A) LED116.4(A) LED117.4(A) LED118.4(A) LED119.4(A) LED120.4(A) LED121.4(A) LED122.4(A) LED123.4(A) LED124.4(A) LED125.4(A) LED126.4(A) LED127.4(A) LED128.4(A)
Y8: LED129.4(A) LED130.4(A) LED131.4(A) LED132.4(A) LED133.4(A) LED134.4(A) LED135.4(A) LED136.4(A) LED137.4(A) LED138.4(A) LED139.4(A) LED140.4(A) LED141.4(A) LED142.4(A) LED143.4(A) LED144.4(A)
Y9: LED145.4(A) LED146.4(A) LED147.4(A) LED148.4(A) LED149.4(A) LED150.4(A) LED151.4(A) LED152.4(A) LED153.4(A) LED154.4(A) LED155.4(A) LED156.4(A) LED157.4(A) LED158.4(A) LED159.4(A) LED160.4(A)
Y10: LED161.4(A) LED162.4(A) LED163.4(A) LED164.4(A) LED165.4(A) LED166.4(A) LED167.4(A) LED168.4(A) LED169.4(A) LED170.4(A) LED171.4(A) LED172.4(A) LED173.4(A) LED174.4(A) LED175.4(A) LED176.4(A)
Y11: LED177.4(A) LED178.4(A) LED179.4(A) LED180.4(A) LED181.4(A) LED182.4(A) LED183.4(A) LED184.4(A) LED185.4(A) LED186.4(A) LED187.4(A) LED188.4(A) LED189.4(A) LED190.4(A) LED191.4(A) LED192.4(A)
Y12: LED193.4(A) LED194.4(A) LED195.4(A) LED196.4(A) LED197.4(A) LED198.4(A) LED199.4(A) LED200.4(A) LED201.4(A) LED202.4(A) LED203.4(A) LED204.4(A) LED205.4(A) LED206.4(A) LED207.4(A) LED208.4(A)
Y13: LED209.4(A) LED210.4(A) LED211.4(A) LED212.4(A) LED213.4(A) LED214.4(A) LED215.4(A) LED216.4(A) LED217.4(A) LED218.4(A) LED219.4(A) LED220.4(A) LED221.4(A) LED222.4(A) LED223.4(A) LED224.4(A)
Y14: LED225.4(A) LED226.4(A) LED227.4(A) LED228.4(A) LED229.4(A) LED230.4(A) LED231.4(A) LED232.4(A) LED233.4(A) LED234.4(A) LED235.4(A) LED236.4(A) LED237.4(A) LED238.4(A) LED239.4(A) LED240.4(A)
Y15: LED241.4(A) LED242.4(A) LED243.4(A) LED244.4(A) LED245.4(A) LED246.4(A) LED247.4(A) LED248.4(A) LED249.4(A) LED250.4(A) LED251.4(A) LED252.4(A) LED253.4(A) LED254.4(A) LED255.4(A) LED256.4(A)

## Library data of the parts
LED1-LED256 = led:GM1WA55311A: Chip LED RGB Source: http://document.sharpsma.com/files/GM1WA55311A_SS.pdf